# Altium schematic sheet Quad-Stage-Prototype_Supply_V1.0.SchDoc: Quad Stage Prototype
size A4; PageSetup: Record=PageOptions|CenterHorizontal=True|CenterVertical=True|PrintScale=0.97|XCorrection=1.00|YCorrection=1.00|PrintKind=0|BorderSize=5000000|LeftOffset=0|BottomOffset=0|Orientation=2|PaperLength=1000|PaperWidth=1000|Scale=100|PaperSource=7|PrintQuality=-3|MediaType=1|DitherType=10|PrintScaleMode=1|PaperKind=A4|PaperIndex=9; Organization: Ostschweizer Fachhochschule; Address2: Florian Baumgartner & Thierry Schwaller; Address3: florian.baumgartner@ost.ch; DocumentNumber: 2; Revision: V1.0; SheetNumber: 2; SheetTotal: 5; Author: Florian Baumgartner & Thierry Schwaller; Subtitle: Power Supply
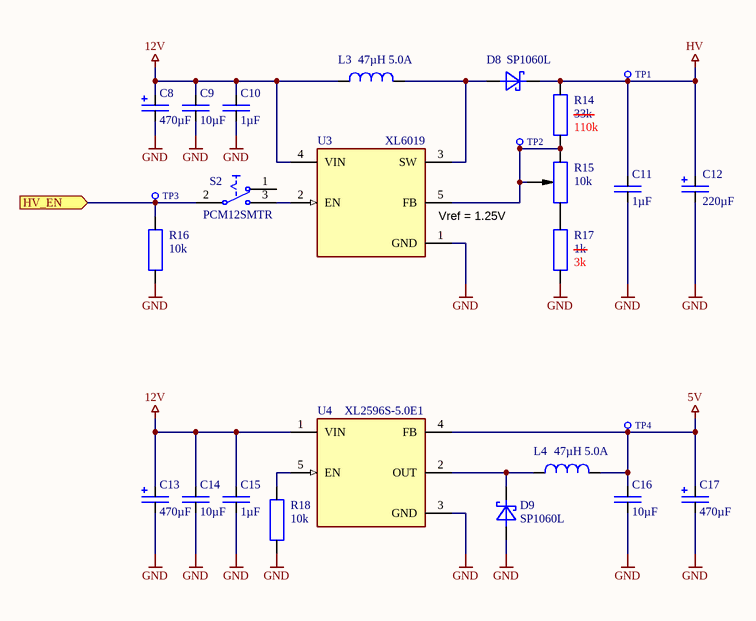
[diagram p0: Quad-Stage-Prototype_Supply_V1.0.SchDoc]

## Parts
C8  470µF  [SMD Elko 10.0x10.0]
C9  10µF  [SMD Keramikkondensator 1206]
C10  1µF  [SMD Keramikkondensator 0603]
C11  1µF  [SMD Keramikkondensator 1206]
C12  220µF  [SMD Elko 12.5x13.5]
C13  470µF  [SMD Elko 10.0x10.0]
C14  10µF  [SMD Keramikkondensator 1206]
C15  1µF  [SMD Keramikkondensator 0603]
C16  10µF  [SMD Keramikkondensator 1206]
C17  470µF  [SMD Elko 10.0x10.0]
D8  SP1060L  [SMD Diode TO-277]
D9  SP1060L  [SMD Diode TO-277]
L3  47µH 5.0A  [SMD Inductor 13.8x12.6x6.5]
L4  47µH 5.0A  [SMD Inductor 13.8x12.6x6.5]
R14  33k  [SMD Widerstand 0603]
R15  10k  [THT Potentiometer (RK09D1130C2P)]
R16  10k  [SMD Widerstand 0603]
R17  1k  [SMD Widerstand 0603]
R18  10k  [SMD Widerstand 0603]
S2  PCM12SMTR  [SMD Switch SPDT (PCM12SMTR)]
TP1  X-TP  [THT Testpunkt Ø1mm]  (value not drawn)  (no BOM)
TP2  X-TP  [THT Testpunkt Ø1mm]  (value not drawn)  (no BOM)
TP3  X-TP  [THT Testpunkt Ø1mm]  (value not drawn)  (no BOM)
TP4  X-TP  [THT Testpunkt Ø1mm]  (value not drawn)  (no BOM)
U3  XL6019  [SMD IC TO-263-5]
U4  XL2596S-5.0E1  [SMD IC TO-263-5]

## Ports
HV_EN (in)

## Nets
5V: C16.2 C17.P(+) L4.1 TP4.1 U4.4(FB)
12V: C8.P(+) C9.2 C10.2 C13.P(+) C14.2 C15.2 L3.1 U3.4(VIN) U4.1(VIN)
GND: C8.M(-) C9.1 C10.1 C11.1 C12.M(-) C13.M(-) C14.1 C15.1 C16.1 C17.M(-) D9.A R16.1 R17.1 R18.1 U3.1(GND) U4.3(GND)
HV: C11.2 C12.P(+) D8.K R14.2 TP1.1
HV_EN: R16.2 S2.2(COMMON1) TP3.1 ; port HV_EN
NetD8_A: D8.A L3.2 U3.3(SW)
NetD9_K: D9.K L4.2 U4.2(OUT)
NetR14_1: R14.1 R15.CW R15.M TP2.1 U3.5(FB)
NetR15_CCW: R15.CCW R17.2
NetR18_2: R18.2 U4.5(EN)
NetS2_3: S2.3(NO1) U3.2(EN)

Not connected (* = marked no-connect by the designer): S2 1(NC1)

## Notes on the sheet
- (near R14) 110k
- (near U3) Vref = 1.25V
- (near R17) 3k
- Title
- Author:
- Subtitle
- Date:
- Rev:
- File:
- Sheet
- of

## Library data of the parts
C8 C13 C17 = C-ELCAP: CAP-Elko; Component Description: Electrolytic Capacitor; Component Value: 470µF 25V; Mouser: 140-VEJ471M1ETR1010; JLC-Parts: C176672; Unit Price: 0.17
C9 C14 C16 = C-CAPACITOR: CAP-MK; Component Description: Multilayer Ceramic Capacitors; Component Value: 10µF 50V; Digikey: 445-7886-1-ND; Farnell: 2211092; Mouser: 810-CGA5L3X5R1H106K; JLC-Parts: C13585; Unit Price: 0.27
C10 C15 = C-CAPACITOR: CAP-MK; Component Description: Multilayer Ceramic Capacitors; Component Value: 1µF 50V; Digikey: 1276-1860-1-ND; Farnell: 3013383; Mouser: 187-CL10A105KB8NNNC; JLC-Parts: C15849; Unit Price: 0.01
C11 = C-CAPACITOR: CAP-MK; Component Description: Multilayer Ceramic Capacitors; Component Value: 1µF 100V; Digikey: 720-VJ1206Y104MXBATCT-ND; Farnell: 1657939; Mouser: 77-VJ1206Y104MXBAT; JLC-Parts: C91151; Unit Price: 0.01
C12 = C-ELCAP: CAP-Elko; Component Description: Electrolytic Capacitor; Component Value: 220µF 63V; JLC-Parts: C249502; Unit Price: 0.42
D8 D9 = R-DIODE:SCHKY: S-DIODE; Component Description: Low Voltage Schottky-Diode; JLC-Parts: C2693399; ComponentLink1Description: Datasheet; ComponentLink1URL: https://datasheet.lcsc.com/lcsc/2103051837_Changjiang-Electronics-Tech--CJ-SP1060L_C2693399.pdf; Component Value: SP1060L; Unit Price: 0.32
L3 L4 = L-COIL: Shielded Power Inductor; ComponentLink1Description: Datasheet; ComponentLink1URL: https://datasheet.lcsc.com/lcsc/2003172239_YJYCOIN-YSPI1365-470M_C497913.pdf; Digikey: 118-SRP1265WA-470MCT-ND; Farnell: 3929029; JLC-Parts: C497913; Mouser: 652-SRP1265WA-470M; Component Description: Shielded Power Inductor; Component Value: 47µH 5.0A; Unit Price: 0.68
R14 = R-RESISTOR: RES (E=Heizwiderstand B=Messwandler); Component Description: Thick Film Chip Resistor; Component Value: 33k (75V, 100mW, 1%); Digikey: P33.0KHCT-ND; Farnell: 2303204; Mouser: 667-ERJ-3EKF3302V; JLC-Parts: C4216; Unit Price: 0.01
R15 = R-RES:VAR: RES-VAR; Component Description: Potentiometer; Component Value: RK09D1130C2P (10k); ComponentLink1Description: Datasheet; ComponentLink1URL: https://tech.alpsalpine.com/prod/e/html/potentiometer/rotarypotentiometers/rk09k/rk09d1130c2p.html; JLC-Parts: C361173; Mouser: 688-RK09D1130C2P; Unit Price: 0.90
R16 R18 = R-RESISTOR: RES (E=Heizwiderstand B=Messwandler); Component Description: Thick Film Chip Resistor; Component Value: 10k (75V, 100mW, 1%); Digikey: P10.0KHCT-ND; Farnell: 2303192; Mouser: 667-ERJ-3EKF1002V; JLC-Parts: C25804; Unit Price: 0.01
R17 = R-RESISTOR: RES (E=Heizwiderstand B=Messwandler); Component Description: Thick Film Chip Resistor; Component Value: 1k (75V, 100mW, 1%); Digikey: P1.00KHCT-ND; Farnell: 2397690; Mouser: 667-ERJ-3EKF1001V; JLC-Parts: C21190; Unit Price: 0.01
S2 = S-PCM12SMTR: Miniature Slide Switch; aliExpress: 33002042977; Component Value: PCM12SMTR (SPDT); Digikey: 401-2016-1-ND; Mouser: 611-PCM12SMTR; Farnell: 9575146; JLC-Parts: C221841; Component Description: Miniature Slide Switch; Unit Price: 0.77
TP1-TP4 = X-TP: Testpunkt; Component Description: Testpoint; Component Value: Ø 0.8mm; Unit Price: 0.00
U3 = U-XL6019: High Power Switching Boost Converter; ComponentLink1Description: Datasheet; ComponentLink1URL: http://www.xlsemi.com/datasheet/XL6019%20datasheet-English.pdf; Component Value: XL6019; JLC-Parts: C73018; Unit Price: 1.00; Component Description: High Power Switching Boost Converter
U4 = U-XL2596S-5.0E1: High Power Switching Buck Converter; ComponentLink1Description: Datasheet; ComponentLink1URL: https://datasheet.lcsc.com/lcsc/1811021340_XLSEMI-XL2596S-5-0E1_C74190.pdf; Component Value: XL2596S-5.0E1; JLC-Parts: C74190; Unit Price: 0.58; Component Description: High Power Switching Buck Converter